# EAGLE schematic little_helper (EAGLE 6.4)
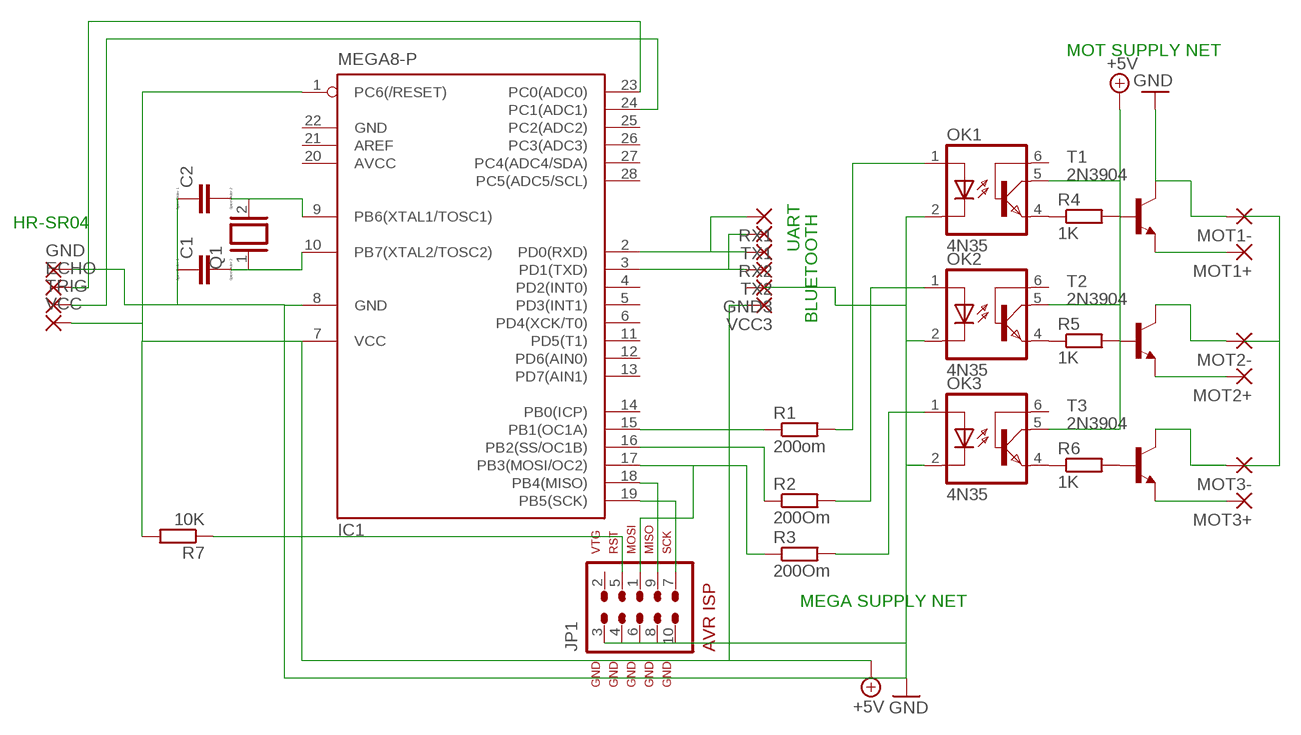
[diagram p0: schematic, sheet 1]

## Parts
C1  CC1206  [C1206]
C2  CC1206  [C1206]
ECHO  1,6/0,8  [1,6/0,8]
GND  1,6/0,8  [1,6/0,8]
GND3  1,6/0,8  [1,6/0,8]
IC1  MEGA8-P  [DIL28-3]
JP1  AVR-ISP-10  [AVR-ISP-10]
MOT1+  1,6/0,8  [1,6/0,8]
MOT1-  1,6/0,8  [1,6/0,8]
MOT2+  1,6/0,8  [1,6/0,8]
MOT2-  1,6/0,8  [1,6/0,8]
MOT3+  1,6/0,8  [1,6/0,8]
MOT3-  1,6/0,8  [1,6/0,8]
OK1  4N35  [DIL06]
OK2  4N35  [DIL06]
OK3  4N35  [DIL06]
Q1  XTAL  [Q]
R1  200om  R-EU_R0603  [R0603]
R2  200Om  R-EU_R0603  [R0603]
R3  200Om  R-EU_R0603  [R0603]
R4  1K  R-EU_R0603  [R0603]
R5  1K  R-EU_R0603  [R0603]
R6  1K  R-EU_R0603  [R0603]
R7  10K  R-EU_R0603  [R0603]
RX1  1,6/0,8  [1,6/0,8]
RX2  1,6/0,8  [1,6/0,8]
T1  2N3904  [TO92]
T2  2N3904  [TO92]
T3  2N3904  [TO92]
TRIG  1,6/0,8  [1,6/0,8]
TX1  1,6/0,8  [1,6/0,8]
TX2  1,6/0,8  [1,6/0,8]
VCC  1,6/0,8  [1,6/0,8]
VCC3  1,6/0,8  [1,6/0,8]

## Nets
+5V: IC1.1(PC6(/RESET)) IC1.7(VCC) OK1.5(COL) OK2.5(COL) OK3.5(COL) R7.2 T1.2(B) T2.2(B) VCC3.1(P) VCC.1(P)
GND: C1.1 C2.1 GND.1(P) IC1.8(GND) JP1.3 JP1.4 JP1.6 JP1.8 JP1.10 MOT1-.1(P) OK1.2(C) OK2.2(C) OK3.2(C) T1.1(C)
GND1: MOT2-.1(P) T2.1(C)
N$1: IC1.15(PB1(OC1A)) R1.1
N$2: IC1.16(PB2(SS/OC1B)) R2.1
N$3: IC1.17(PB3(MOSI/OC2)) JP1.1 R3.1
N$4: OK1.1(A) R1.2
N$5: OK2.1(A) R2.2
N$6: OK3.1(A) R3.2
N$7: OK1.4(EMI) R4.1
N$8: OK2.4(EMI) R5.1
N$9: OK3.4(EMI) R6.1
N$10: R6.2 T3.2(B)
N$13: MOT1+.1(P) T1.3(E)
N$14: MOT2+.1(P) T2.3(E)
N$15: MOT3+.1(P) T3.3(E)
N$16: C2.2 IC1.9(PB6(XTAL1/TOSC1)) Q1.2
N$17: C1.2 IC1.10(PB7(XTAL2/TOSC2)) Q1.1
N$18: IC1.19(PB5(SCK)) JP1.7
N$19: IC1.18(PB4(MISO)) JP1.9
N$20: JP1.5 R7.1
N$21: IC1.24(PC1(ADC1)) TRIG.1(P)
N$22: ECHO.1(P) IC1.23(PC0(ADC0))
N$23: IC1.2(PD0(RXD)) RX1.1(P) RX2.1(P)
N$24: IC1.3(PD1(TXD)) TX1.1(P) TX2.1(P)
N$27: MOT3-.1(P) T3.1(C)
Unconnected: GND3.1(P) IC1.4(PD2(INT0)) IC1.5(PD3(INT1)) IC1.6(PD4(XCK/T0)) IC1.11(PD5(T1)) IC1.12(PD6(AIN0)) IC1.13(PD7(AIN1)) IC1.14(PB0(ICP)) IC1.21(AREF) IC1.25(PC2(ADC2)) IC1.26(PC3(ADC3)) IC1.27(PC4(ADC4/SDA)) IC1.28(PC5(ADC5/SCL)) JP1.2 OK1.6(BAS) OK2.6(BAS) OK3.6(BAS) R4.2 R5.2

## Notes on the sheet
- MOT SUPPLY NET
- HR-SR04
- UART
- BLUETOOTH
- MEGA SUPPLY NET

## Power pins joined to a net without a drawn wire
AVCC: IC1.20(AVCC)
GND: IC1.22(GND)

## Library data of the parts
C1 C2 = eagle-ltspice:C: CAPACITOR, European symbol; SPICEMODEL: NONE; SPICEPREFIX: C
ECHO GND GND3 MOT1+ MOT1- MOT2+ MOT2- MOT3+ MOT3- RX1 RX2 TRIG TX1 TX2 VCC VCC3 = wirepad:1,6/0,8: THROUGH-HOLE PAD
IC1 = atmel:MEGA8-P: MICROCONTROLLER 8 Kbytes FLASH, 1 kbytes SRAM, 512 bytes EEPROM, USART, 4-channel 10 bit ADC, 2-channel 8 bit ADC Pin compatible with Atmega48, ATMega88, ATMega168 Source: avr.lbr; OC_FARNELL: unknown; OC_NEWARK: unknown
JP1 = avr-5:AVR-ISP-10: AVR ISP-10 Serial Programming Header
OK1-OK3 = optocoupler:4N35: MOTOROLA OPTO COUPLER; MF: FAIRCHILD SEMICONDUCTOR; MPN: 4N35; OC_FARNELL: 1328375; OC_NEWARK: 72K9946
Q1 = special:XTAL: CRYSTAL
R1-R7 = rcl:R-EU_: RESISTOR, European symbol
T1-T3 = transistor:2N3904: NPN TRANSISTOR